# Altium schematic sheet Main.SchDoc
size A4; SheetNumber: 1; SheetTotal: 6
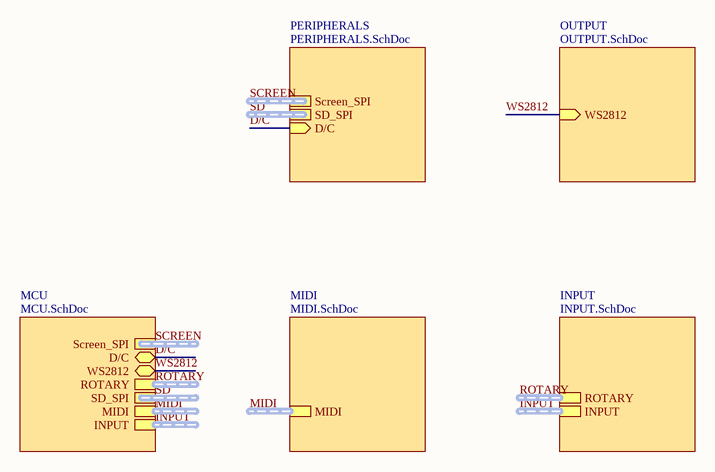
[diagram p0: Main.SchDoc]

## Sub-sheets
INPUT = INPUT.SchDoc: INPUT (harness INPUT), ROTARY (harness ROT)
MCU = MCU.SchDoc: Screen_SPI (harness SPI), D/C (bidir), WS2812 (bidir), ROTARY (harness ROT), SD_SPI (harness SPI), MIDI (harness MIDI), INPUT (harness INPUT)
MIDI = MIDI.SchDoc: MIDI (harness MIDI)
OUTPUT = OUTPUT.SchDoc: WS2812 (in)
PERIPHERALS = PERIPHERALS.SchDoc: Screen_SPI (harness SPI), SD_SPI (harness SPI), D/C (in)

## Nets
D/C: sheet MCU/D/C, sheet PERIPHERALS/D/C
WS2812: sheet MCU/WS2812, sheet OUTPUT/WS2812

## Buses and harness runs
harness INPUT = sheet INPUT/INPUT
harness INPUT = sheet MCU/INPUT
harness MIDI = sheet MCU/MIDI
harness MIDI = sheet MIDI/MIDI
harness ROTARY = sheet INPUT/ROTARY
harness ROTARY = sheet MCU/ROTARY
harness SCREEN = sheet MCU/Screen_SPI
harness SCREEN = sheet PERIPHERALS/Screen_SPI
harness SD = sheet MCU/SD_SPI
harness SD = sheet PERIPHERALS/SD_SPI